# EAGLE design 00A-094 (EAGLE 9.6.2)
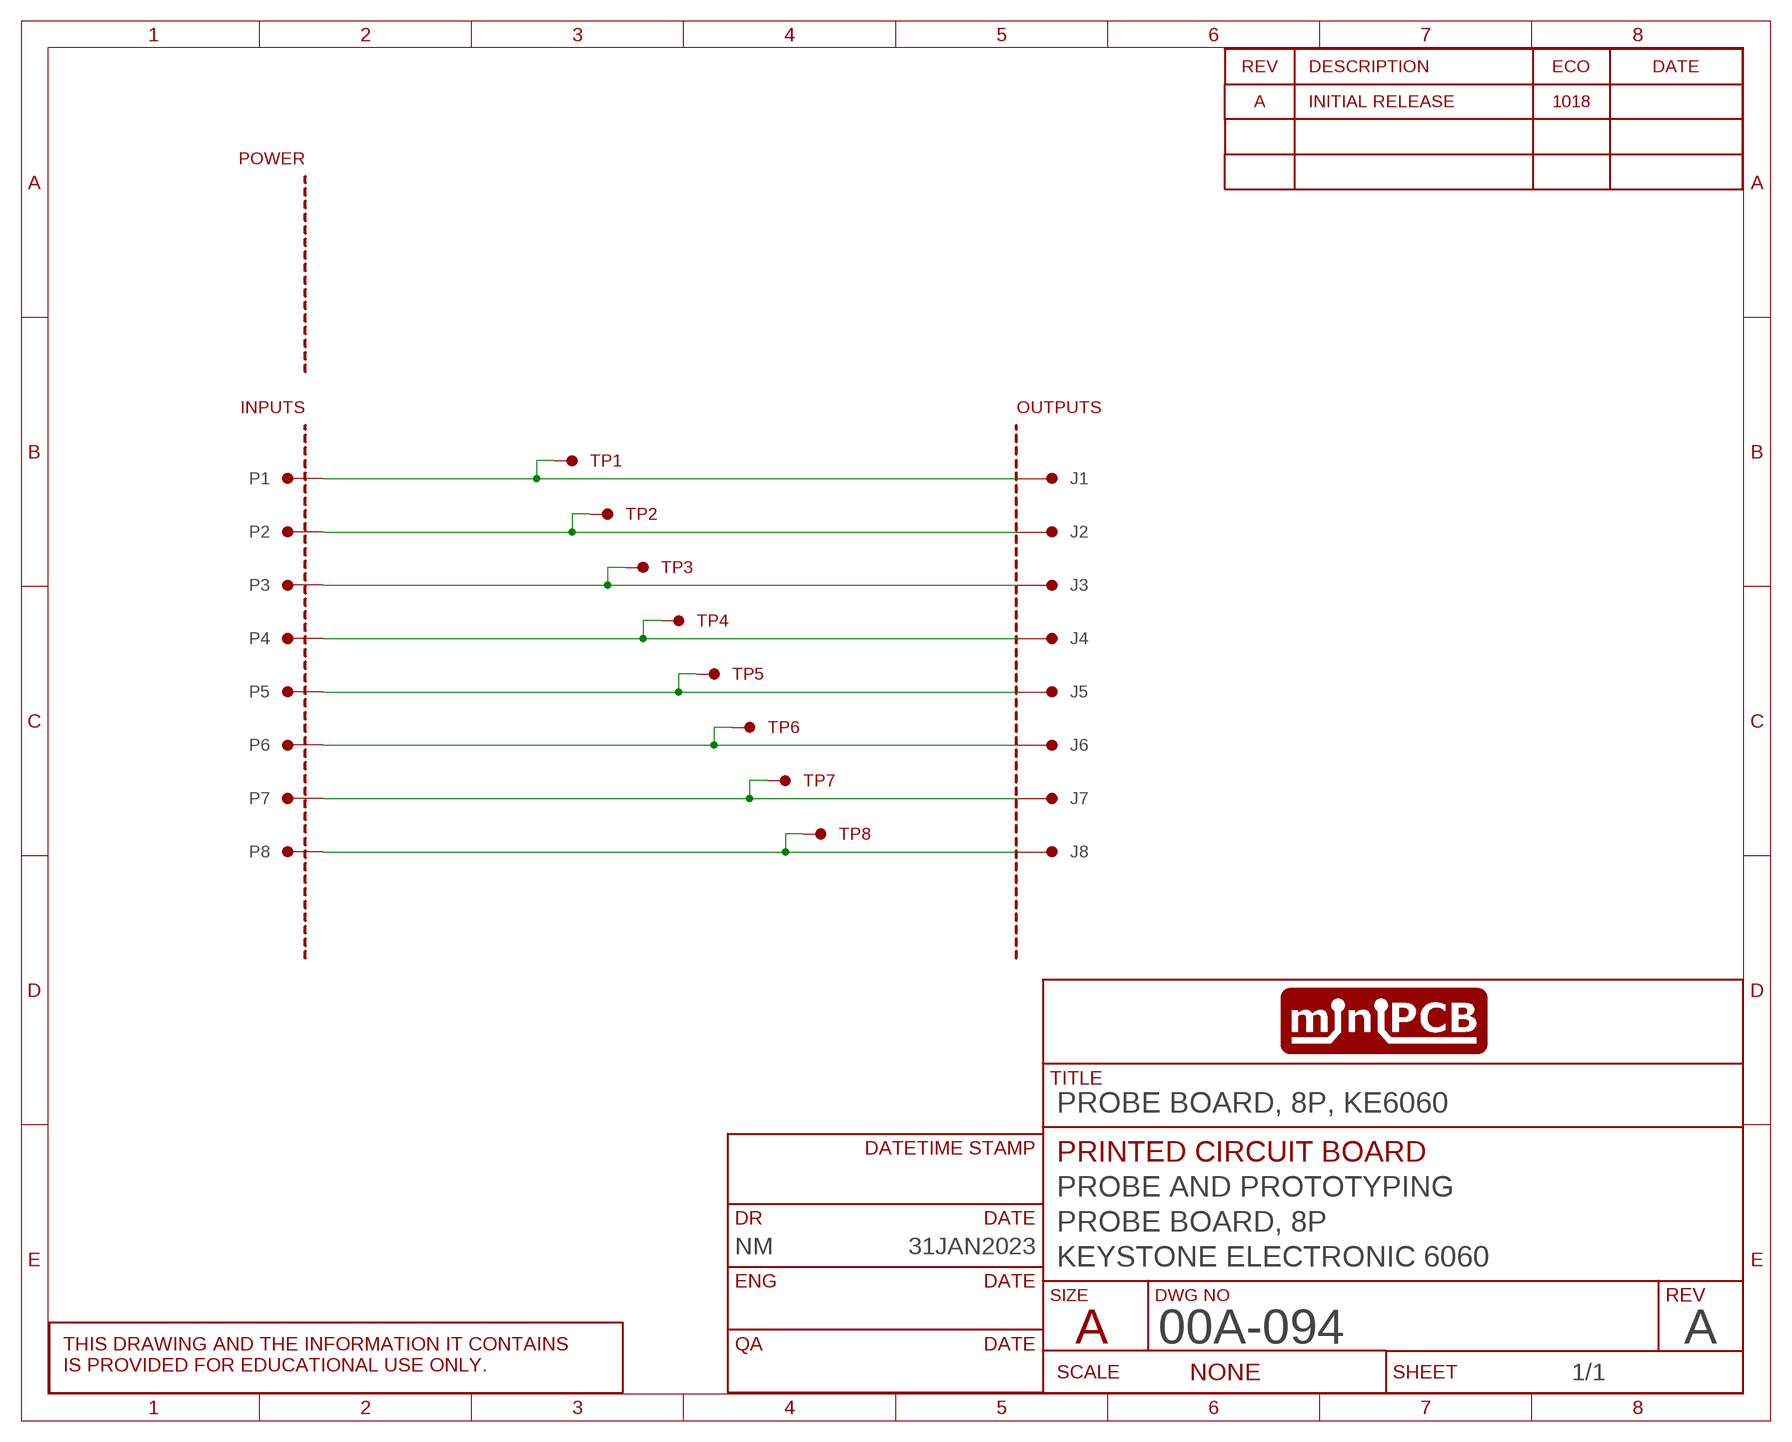
[diagram p0: schematic, sheet 1]
SHEET1 (SCHEMATIC): CIRCUIT_CATEGORY: PROBE AND PROTOTYPING; CIRCUIT_NAME: PROBE BOARD, 8P; CIRCUIT_VARIANT: KEYSTONE ELECTRONIC 6060; DR: NM; DR_DATE: 31JAN2023; PCB_PCBA: PRINTED CIRCUIT BOARD; REVA: A; REVA_ECO: 1018; REVISION: A; TITLE: PROBE BOARD, 8P, KE6060

## Parts
J1  PINS_1KE6060  [PINS_1_KE6060]
J2  PINS_1KE6060  [PINS_1_KE6060]
J3  PINS_1KE6060  [PINS_1_KE6060]
J4  PINS_1KE6060  [PINS_1_KE6060]
J5  PINS_1KE6060  [PINS_1_KE6060]
J6  PINS_1KE6060  [PINS_1_KE6060]
J7  PINS_1KE6060  [PINS_1_KE6060]
J8  PINS_1KE6060  [PINS_1_KE6060]
P1  PINS_124AWG-NOTEXT  [PINS_1_1MM-NOTEXT]
P2  PINS_124AWG-NOTEXT  [PINS_1_1MM-NOTEXT]
P3  PINS_124AWG-NOTEXT  [PINS_1_1MM-NOTEXT]
P4  PINS_124AWG-NOTEXT  [PINS_1_1MM-NOTEXT]
P5  PINS_124AWG-NOTEXT  [PINS_1_1MM-NOTEXT]
P6  PINS_124AWG-NOTEXT  [PINS_1_1MM-NOTEXT]
P7  PINS_124AWG-NOTEXT  [PINS_1_1MM-NOTEXT]
P8  PINS_124AWG-NOTEXT  [PINS_1_1MM-NOTEXT]
PCB1  MINIPCB_0P00A-20X100  [MINIPCB_00A_20X100]
TP1  TESTPOINTKE5000-SMTEXT  [PINS_1_TESTPOINT_KE5000_NOTEXT]
TP2  TESTPOINTKE5000-SMTEXT  [PINS_1_TESTPOINT_KE5000_NOTEXT]
TP3  TESTPOINTKE5000-SMTEXT  [PINS_1_TESTPOINT_KE5000_NOTEXT]
TP4  TESTPOINTKE5000-SMTEXT  [PINS_1_TESTPOINT_KE5000_NOTEXT]
TP5  TESTPOINTKE5000-SMTEXT  [PINS_1_TESTPOINT_KE5000_NOTEXT]
TP6  TESTPOINTKE5000-SMTEXT  [PINS_1_TESTPOINT_KE5000_NOTEXT]
TP7  TESTPOINTKE5000-SMTEXT  [PINS_1_TESTPOINT_KE5000_NOTEXT]
TP8  TESTPOINTKE5000-SMTEXT  [PINS_1_TESTPOINT_KE5000_NOTEXT]

## Nets
N$1: J1.1 J1.2 P1.1 P1.2 TP1.1
N$2: J8.1 J8.2 P8.1 P8.2 TP8.1
N$3: J2.1 J2.2 P2.1 P2.2 TP2.1
N$5: J3.1 J3.2 P3.1 P3.2 TP3.1
N$7: J4.1 J4.2 P4.1 P4.2 TP4.1
N$9: J5.1 J5.2 P5.1 P5.2 TP5.1
N$11: J6.1 J6.2 P6.1 P6.2 TP6.1
N$14: J7.1 J7.2 P7.1 P7.2 TP7.1

## Library data of the parts
J1-J8 P1-P8 = minipcb:PINS_1
PCB1 = minipcb:MINIPCB_0P; PART_NUMBER: 00A-094-A
TP1-TP8 = minipcb:TESTPOINT

## Board
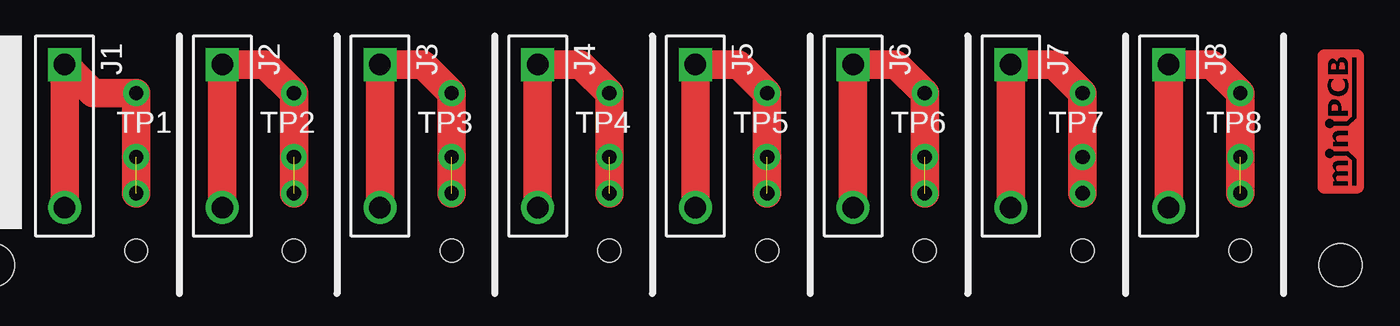
[diagram p1: board, top side]
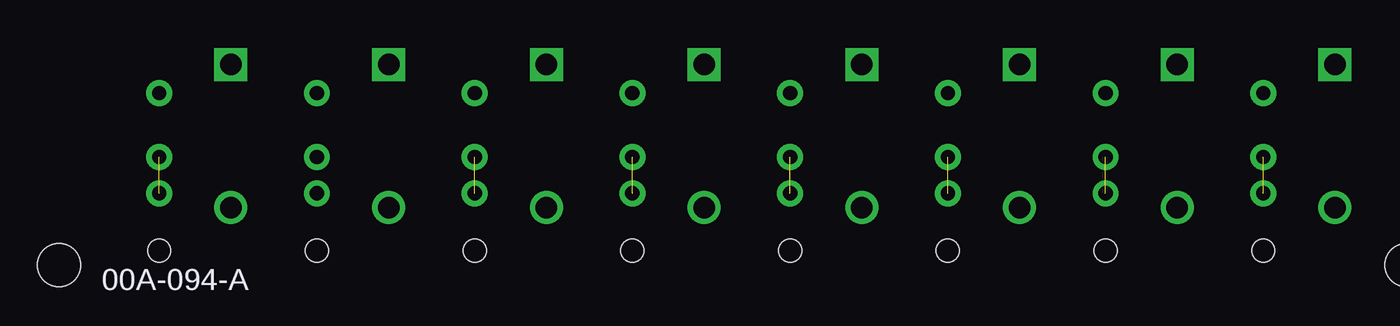
[diagram p2: board, bottom side, seen from below]

No outline drawn. Coordinates in mm, seen from the top.
Copper layers (1*16): Top 0.035mm / dielectric 1.5mm / Bottom 0.035mm
Design rules "minipcb": minimum track width 0.2mm, minimum drill 0.5mm, track to track 0.25mm, track to pad 0.5mm, pad to pad 0.5mm, via to via 0.5mm, smd to smd 0.15mm, copper to edge 1mm, drill to drill 1mm, minimum pad ring 0.4mm, minimum via ring 0.4mm, stop-mask expansion 0.1mm, vias tented up to drill 0.6mm, thermal gap 0.5mm

### Footprints (pad centres in the part's own frame; a part is rotated, then mirrored left to right if it is on the bottom)
PINS_1_KE6060 = drill 1.5 square: 1 -5,0 | drill 1.5: 2 5,0
PINS_1_1MM-NOTEXT = drill 1 pad 1.6: 1 4,0; 2 6.54,0 | hole 1.6: 0,0
MINIPCB_00A_20X100 = hole 3: 97,3; 3,3
PINS_1_TESTPOINT_KE5000_NOTEXT = drill 1: 1 0,0

### Placement (x,y rotation side)
J1  8,12 270 top
J2  19,12 270 top
J3  30,12 270 top
J4  41,12 270 top
J5  52,12 270 top
J6  63,12 270 top
J7  74,12 270 top
J8  85,12 270 top
P1  13,4 90 top
P2  24,4 90 top
P3  35,4 90 top
P4  46,4 90 top
P5  57,4 90 top
P6  68,4 90 top
P7  79,4 90 top
P8  90,4 90 top
PCB1  0,0 0 top
TP1  13,15 180 top
TP2  24,15 180 top
TP3  35,15 180 top
TP4  46,15 180 top
TP5  57,15 180 top
TP6  68,15 180 top
TP7  79,15 180 top
TP8  90,15 180 top

### Tracks (layer width: path | path; a pad name or v marks a point on that pad's centre or on a via)
N$1  (1 unrouted)
  Top 2: J1.2 J1.1 10,15 TP1.1 P1.1
N$2  (1 unrouted)
  Top 2: J8.2 J8.1 88,17 TP8.1 P8.1
N$3  (1 unrouted)
  Top 2: J2.2 J2.1 22,17 TP2.1 P2.1
N$5  (1 unrouted)
  Top 2: J3.2 J3.1 33,17 TP3.1 P3.1
N$7  (1 unrouted)
  Top 2: J4.2 J4.1 44,17 TP4.1 P4.1
N$9  (1 unrouted)
  Top 2: J5.2 J5.1 55,17 TP5.1 P5.1
N$11  (1 unrouted)
  Top 2: J6.2 J6.1 66,17 TP6.1 P6.1
N$14
  Top 2: J7.2 J7.1 77,17 TP7.1 P7.2 P7.1

### Text on the board
_tNames: J1 | J2 | J3 | J4 | J5 | J6 | J7 | J8 | TP1 | TP2 | TP3 | TP4 | TP5 | TP6 | TP7 | TP8